# EAGLE design Atmega_128 Dev Board (EAGLE 8.5.1)
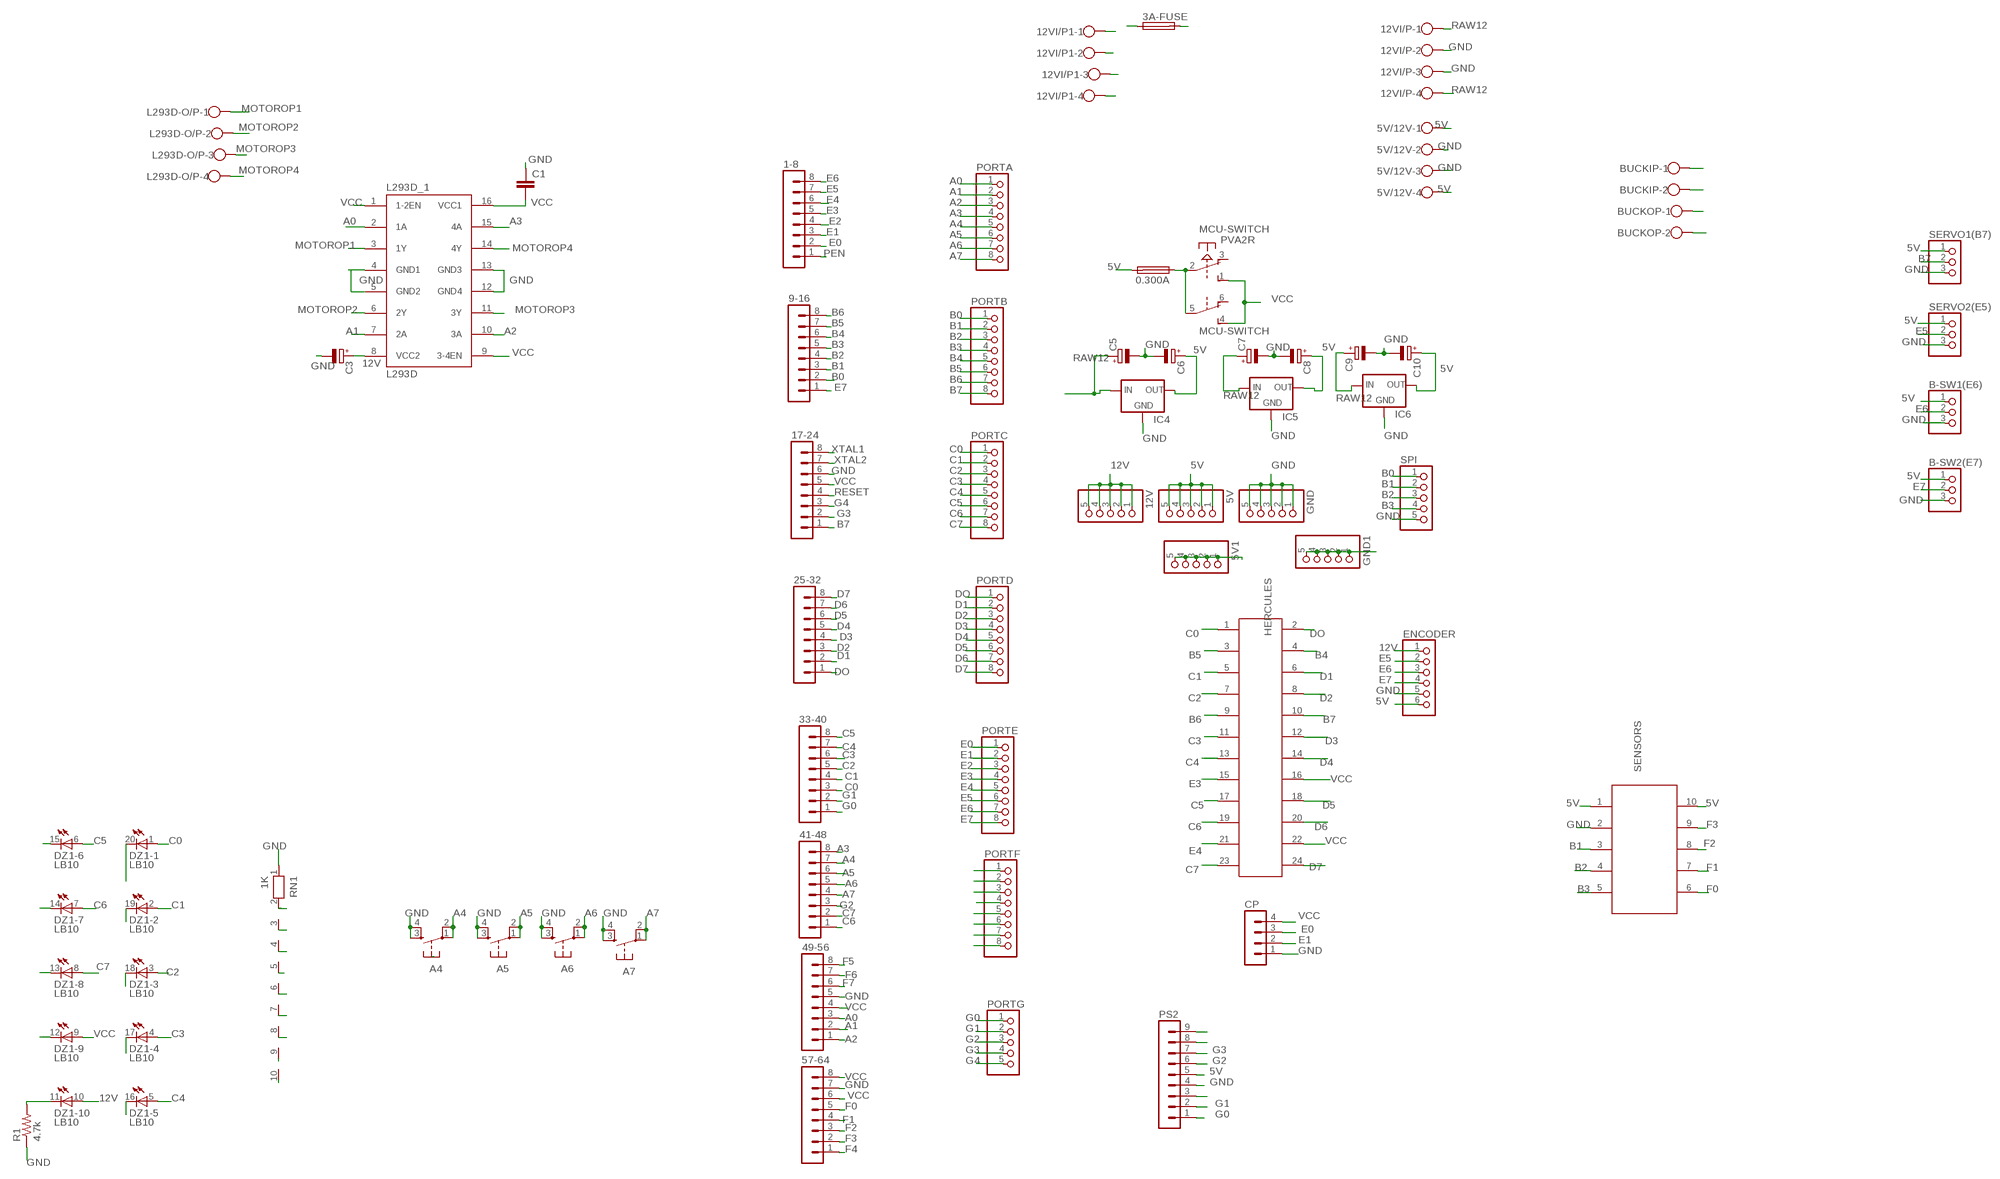
[diagram p0: schematic, sheet 1]

## Parts
0.300A  SH25  [SH25]
1-8  MA08-1  [MA08-1]
3A-FUSE  SH25  [SH25]
5V  PINHD-1X5  [1X05]
5V1  PINHD-1X5  [1X05]
5V/12V  W237-4  [W237-4]
9-16  MA08-1  [MA08-1]
12V  PINHD-1X5  [1X05]
12VI/P  W237-4  [W237-4]
12VI/P1  W237-4  [W237-4]
17-24  MA08-1  [MA08-1]
25-32  MA08-1  [MA08-1]
33-40  MA08-1  [MA08-1]
41-48  MA08-1  [MA08-1]
49-56  MA08-1  [MA08-1]
57-64  MA08-1  [MA08-1]
A4  DTS-6  [DTS-6]
A5  DTS-6  [DTS-6]
A6  DTS-6  [DTS-6]
A7  DTS-6  [DTS-6]
B-SW1(E6)  PINHD-1X3  [1X03]
B-SW2(E7)  PINHD-1X3  [1X03]
BUCKIP  W237-102  [W237-102]
BUCKOP  W237-102  [W237-102]
C1  C5/2.5  [C5B2.5]
C3  CPOL-EUE2.5-5  [E2,5-5]
C5  CPOL-EUE2.5-5  [E2,5-5]
C6  CPOL-EUE2.5-5  [E2,5-5]
C7  CPOL-EUE2.5-5  [E2,5-5]
C8  CPOL-EUE2.5-5  [E2,5-5]
C9  CPOL-EUE2.5-5  [E2,5-5]
C10  CPOL-EUE2.5-5  [E2,5-5]
CP  MA04-1  [MA04-1]
DZ1  LB10  [LB10]
ENCODER  PINHD-1X6  [1X06]
GND  PINHD-1X5  [1X05]
GND1  PINHD-1X5  [1X05]
HERCULES  61202421621  [61202421621]
IC4  78XXS  [78XXS]
IC5  78XXS  [78XXS]
IC6  78XXS  [78XXS]
L293D-O/P  W237-4  [W237-4]
L293D_1  L293D  [DIL16]
MCU-SWITCH  PVA2R  [PVA2R]
PORTA  PINHD-1X8  [1X08]
PORTB  PINHD-1X8  [1X08]
PORTC  PINHD-1X8  [1X08]
PORTD  PINHD-1X8  [1X08]
PORTE  PINHD-1X8  [1X08]
PORTF  PINHD-1X8  [1X08]
PORTG  PINHD-1X5  [1X05]
PS2  MA09-1  [MA09-1]
R1  4.7k  R-US_0204/7  [0204/7]
RN1  1K  RN09  [RN-10]
SENSORS  66101021622  [66101021622]
SERVO1(B7)  PINHD-1X3  [1X03]
SERVO2(E5)  PINHD-1X3  [1X03]
SPI  PINHD-1X5  [1X05]

## Nets
2: DZ1.12(-9:C) RN1.2
3: DZ1.13(-8:C) RN1.3
4: DZ1.14(-7:C) RN1.4
5: DZ1.15(-6:C) RN1.5
5V: 0.300A.2 5V1.1 5V1.2 5V1.3 5V1.4 5V1.5 5V.1 5V.2 5V.3 5V.4 5V.5 5V/12V.1 5V/12V.4 B-SW1(E6).1 B-SW2(E7).1 BUCKOP.2 C6.+ C8.+ C10.+ ENCODER.6 IC4.OUT IC5.OUT IC6.OUT PS2.5 SENSORS.1 SENSORS.10 SERVO1(B7).1 SERVO2(E5).1
5V-F: 0.300A.1 MCU-SWITCH.2(1:P) MCU-SWITCH.5(2:P)
6: DZ1.16(-5:C) RN1.6
7: DZ1.17(-4:C) RN1.7
8: DZ1.18(-3:C) RN1.8
9: DZ1.19(-2:C) RN1.9
10: DZ1.20(-1:C) RN1.10
12V: 3A-FUSE.2 12V.1 12V.2 12V.3 12V.4 12V.5 C3.+ DZ1.10(-10:A) ENCODER.1 L293D_1.8(VCC2)
A0: 49-56.3 L293D_1.2(1A) PORTA.1
A1: 49-56.2 L293D_1.7(2A) PORTA.2
A2: 49-56.1 L293D_1.10(3A) PORTA.3
A3: 41-48.8 L293D_1.15(4A) PORTA.4
A4: 41-48.7 A4.1 A4.2 PORTA.5
A5: 41-48.6 A5.1 A5.2 PORTA.6
A6: 41-48.5 A6.1 A6.2 PORTA.7
A7: 41-48.4 A7.1 A7.2 PORTA.8
B0: 9-16.2 PORTB.1 SPI.1
B1: 9-16.3 PORTB.2 SENSORS.3 SPI.2
B2: 9-16.4 PORTB.3 SENSORS.4 SPI.3
B3: 9-16.5 PORTB.4 SENSORS.5 SPI.4
B4: 9-16.6 HERCULES.4 PORTB.5
B5: 9-16.7 HERCULES.3 PORTB.6
B6: 9-16.8 HERCULES.9 PORTB.7
B7: 17-24.1 HERCULES.10 PORTB.8 SERVO1(B7).2
C0: 33-40.3 DZ1.1(-1:A) HERCULES.1 PORTC.1
C1: 33-40.4 DZ1.2(-2:A) HERCULES.5 PORTC.2
C2: 33-40.5 DZ1.3(-3:A) HERCULES.7 PORTC.3
C3: 33-40.6 DZ1.4(-4:A) HERCULES.11 PORTC.4
C4: 33-40.7 DZ1.5(-5:A) HERCULES.13 PORTC.5
C5: 33-40.8 DZ1.6(-6:A) HERCULES.17 PORTC.6
C6: 41-48.1 DZ1.7(-7:A) HERCULES.19 PORTC.7
C7: 41-48.2 DZ1.8(-8:A) HERCULES.23 PORTC.8
D1: 25-32.2 HERCULES.6 PORTD.2
D2: 25-32.3 HERCULES.8 PORTD.3
D3: 25-32.4 HERCULES.12 PORTD.4
D4: 25-32.5 HERCULES.14 PORTD.5
D5: 25-32.6 HERCULES.18 PORTD.6
D6: 25-32.7 HERCULES.20 PORTD.7
D7: 25-32.8 HERCULES.24 PORTD.8
DO: 25-32.1 HERCULES.2 PORTD.1
E0: 1-8.2 CP.3 PORTE.1
E1: 1-8.3 CP.2 PORTE.2
E2: 1-8.4 PORTE.3
E3: 1-8.5 HERCULES.15 PORTE.4
E4: 1-8.6 HERCULES.21 PORTE.5
E5: 1-8.7 ENCODER.2 PORTE.6 SERVO2(E5).2
E6: 1-8.8 B-SW1(E6).2 ENCODER.3 PORTE.7
E7: 9-16.1 B-SW2(E7).2 ENCODER.4 PORTE.8
F0: 57-64.5 PORTF.1 SENSORS.6
F1: 57-64.4 PORTF.2 SENSORS.7
F2: 57-64.3 PORTF.3 SENSORS.8
F3: 57-64.2 PORTF.4 SENSORS.9
F4: 57-64.1 PORTF.5
F5: 49-56.8 PORTF.6
F6: 49-56.7 PORTF.7
F7: 49-56.6 PORTF.8
G0: 33-40.1 PORTG.1 PS2.1
G1: 33-40.2 PORTG.2 PS2.2
G2: 41-48.3 PORTG.3 PS2.6
G3: 17-24.2 PORTG.4 PS2.7
G4: 17-24.3 PORTG.5
GND: 5V/12V.2 5V/12V.3 12VI/P1.2 12VI/P1.3 12VI/P.2 12VI/P.3 17-24.6 49-56.5 57-64.7 A4.3 A4.4 A5.3 A5.4 A6.3 A6.4 A7.3 A7.4 B-SW1(E6).3 B-SW2(E7).3 BUCKIP.2 BUCKOP.1 C1.1 C3.- C5.- C6.- C7.- C8.- C9.- C10.- CP.1 ENCODER.5 GND1.1 GND1.2 GND1.3 GND1.4 GND1.5 GND.1 GND.2 GND.3 GND.4 GND.5 IC4.GND IC5.GND IC6.GND L293D_1.4(GND1) L293D_1.5(GND2) L293D_1.12(GND4) L293D_1.13(GND3) PS2.4 R1.1 RN1.1 SENSORS.2 SERVO1(B7).3 SERVO2(E5).3 SPI.5
MOTOROP1: L293D-O/P.1 L293D_1.3(1Y)
MOTOROP2: L293D-O/P.2 L293D_1.6(2Y)
MOTOROP3: L293D-O/P.3 L293D_1.11(3Y)
MOTOROP4: L293D-O/P.4 L293D_1.14(4Y)
N$4: PS2.9
N$6: PS2.8
N$17: PS2.3
N$23: DZ1.11(-10:C) R1.2
PEN: 1-8.1
RAW12: 3A-FUSE.1 12VI/P1.1 12VI/P1.4 12VI/P.1 12VI/P.4 BUCKIP.1 C5.+ C7.+ C9.+ IC4.IN IC5.IN IC6.IN
RESET: 17-24.4
VCC: 17-24.5 49-56.4 57-64.6 57-64.8 C1.2 CP.4 DZ1.9(-9:A) HERCULES.16 HERCULES.22 L293D_1.1(1-2EN) L293D_1.9(3-4EN) L293D_1.16(VCC1) MCU-SWITCH.1(1:S) MCU-SWITCH.4(2:S)
XTAL1: 17-24.8
XTAL2: 17-24.7
Unconnected: MCU-SWITCH.3(1:O) MCU-SWITCH.6(2:O)

## Library data of the parts
0.300A 3A-FUSE = fuse:SH25: FUSE HOLDER grid 25 mm, OGN0031 8211, Schurter (Buerklin); MF: SCHURTER; MPN: 0031.8211; OC_FARNELL: 1162741; OC_NEWARK: 96B9380
1-8 9-16 17-24 25-32 33-40 41-48 49-56 57-64 = con-lstb:MA08-1: PIN HEADER; OC_FARNELL: unknown; OC_NEWARK: unknown
5V 5V1 12V GND GND1 PORTG SPI = pinhead:PINHD-1X5: PIN HEADER
5V/12V 12VI/P 12VI/P1 L293D-O/P = con-wago-500:W237-4: WAGO SCREW CLAMP; OC_FARNELL: unknown; OC_NEWARK: unknown
A4-A7 = switch-tact:DTS-6
B-SW1(E6) B-SW2(E7) SERVO1(B7) SERVO2(E5) = pinhead:PINHD-1X3: PIN HEADER
BUCKIP BUCKOP = con-wago-500:W237-102: WAGO SCREW CLAMP; MPN: 237-102; OC_FARNELL: unknown; OC_NEWARK: 70K9898
C1 = capacitor-wima:C: CAPACITOR naming: grid - package width
C3 C5-C10 = resistor:CPOL-EU: POLARIZED CAPACITOR, European symbol
CP = con-lstb:MA04-1: PIN HEADER; OC_FARNELL: unknown; OC_NEWARK: unknown
DZ1 = led:LB10: LED BLOCK 10-LED bar graph, DIL, Siemens
ENCODER = pinhead:PINHD-1X6: PIN HEADER
HERCULES = Wurth_Elektronik_Electromechanic_Wire_to_Board_Connectors_rev17b:61202421621: WR-BHD 2.54mm Male Box Header, 24 Pins=>Code : Con_WTB_BHD_2.54_Male_THT_WS_61202421621 <http://katalog.we-online.de/media/thumbs2/eican/thb_Con_WTB_BHD_2.54_Male_THT_WS_6120xx21621_pf2.jpg> Details see: http://katalog.we-online.de/en/em/612_0xx_216_21 Created 2014-06-04, Karrer Zheng 2014 (C) Würth Elektronik
IC4-IC6 = v-reg:78XXS: VOLTAGE REGULATOR
L293D_1 = st-microelectronics:L293D: PUSH-PULL 4 CHANNEL DRIVER; MPN: L293D; OC_FARNELL: 9589619; OC_NEWARK: 56P8249
MCU-SWITCH = switch-misc:PVA2R: ITT SWITCH
PORTA PORTB PORTC PORTD PORTE PORTF = pinhead:PINHD-1X8: PIN HEADER
PS2 = con-lstb:MA09-1: PIN HEADER; OC_FARNELL: unknown; OC_NEWARK: unknown
R1 = rcl:R-US_: RESISTOR, American symbol; SPICEPREFIX: R
RN1 = resistor-net:RN09: RESISTOR NETWORK; OC_FARNELL: unknown; OC_NEWARK: unknown
SENSORS = Wurth_Elektronik_Electromechanic_Wire_to_Board_Connectors_rev17b:66101021622: WIRE TO BOARD CONNECTION - 2.54 MM - SHROUDED HEADER - STRAIGHT - GLOW WIRE PLASTIC - WR-WTB =>ConWTB254 66101021622 Characteristics INSULATOR: PA46G15 FLAMMABILITY RATING: UL94V0 COLOR: BLACK METAL: PHOSPHOR BRONZE PLATING: TIN OVER Ni QUALITY CLASS: 25 MATING CYCLES OPERATING TEMPERATURE:-40°C UP TO +125°C COMPLIANCE: LEAD FREE AND ROHS ELECTRICAL CURRENT RATING: 3 A WORKING VOLTAGE: 50 VAC WITHSTANDING VOLTAGE: 500 VAC/MIN INSULATION RESISTANCE: >1000 MΩ CONTACT RESISTANCE: 20 mΩ MAX <http://katalog.we-online.de/media/images/v2/Family_WR-WTB_6610xx11622_2%2054.jpg> Details see: http://katalog.we-online.de/en/em/WTB_2_54_MALE_HORIZONTAL_SHROUDED_HEADER_GLOW_WIRE_PLASTIC_6610XXX1622 2015 (C) Wurth Elektronik

## Board
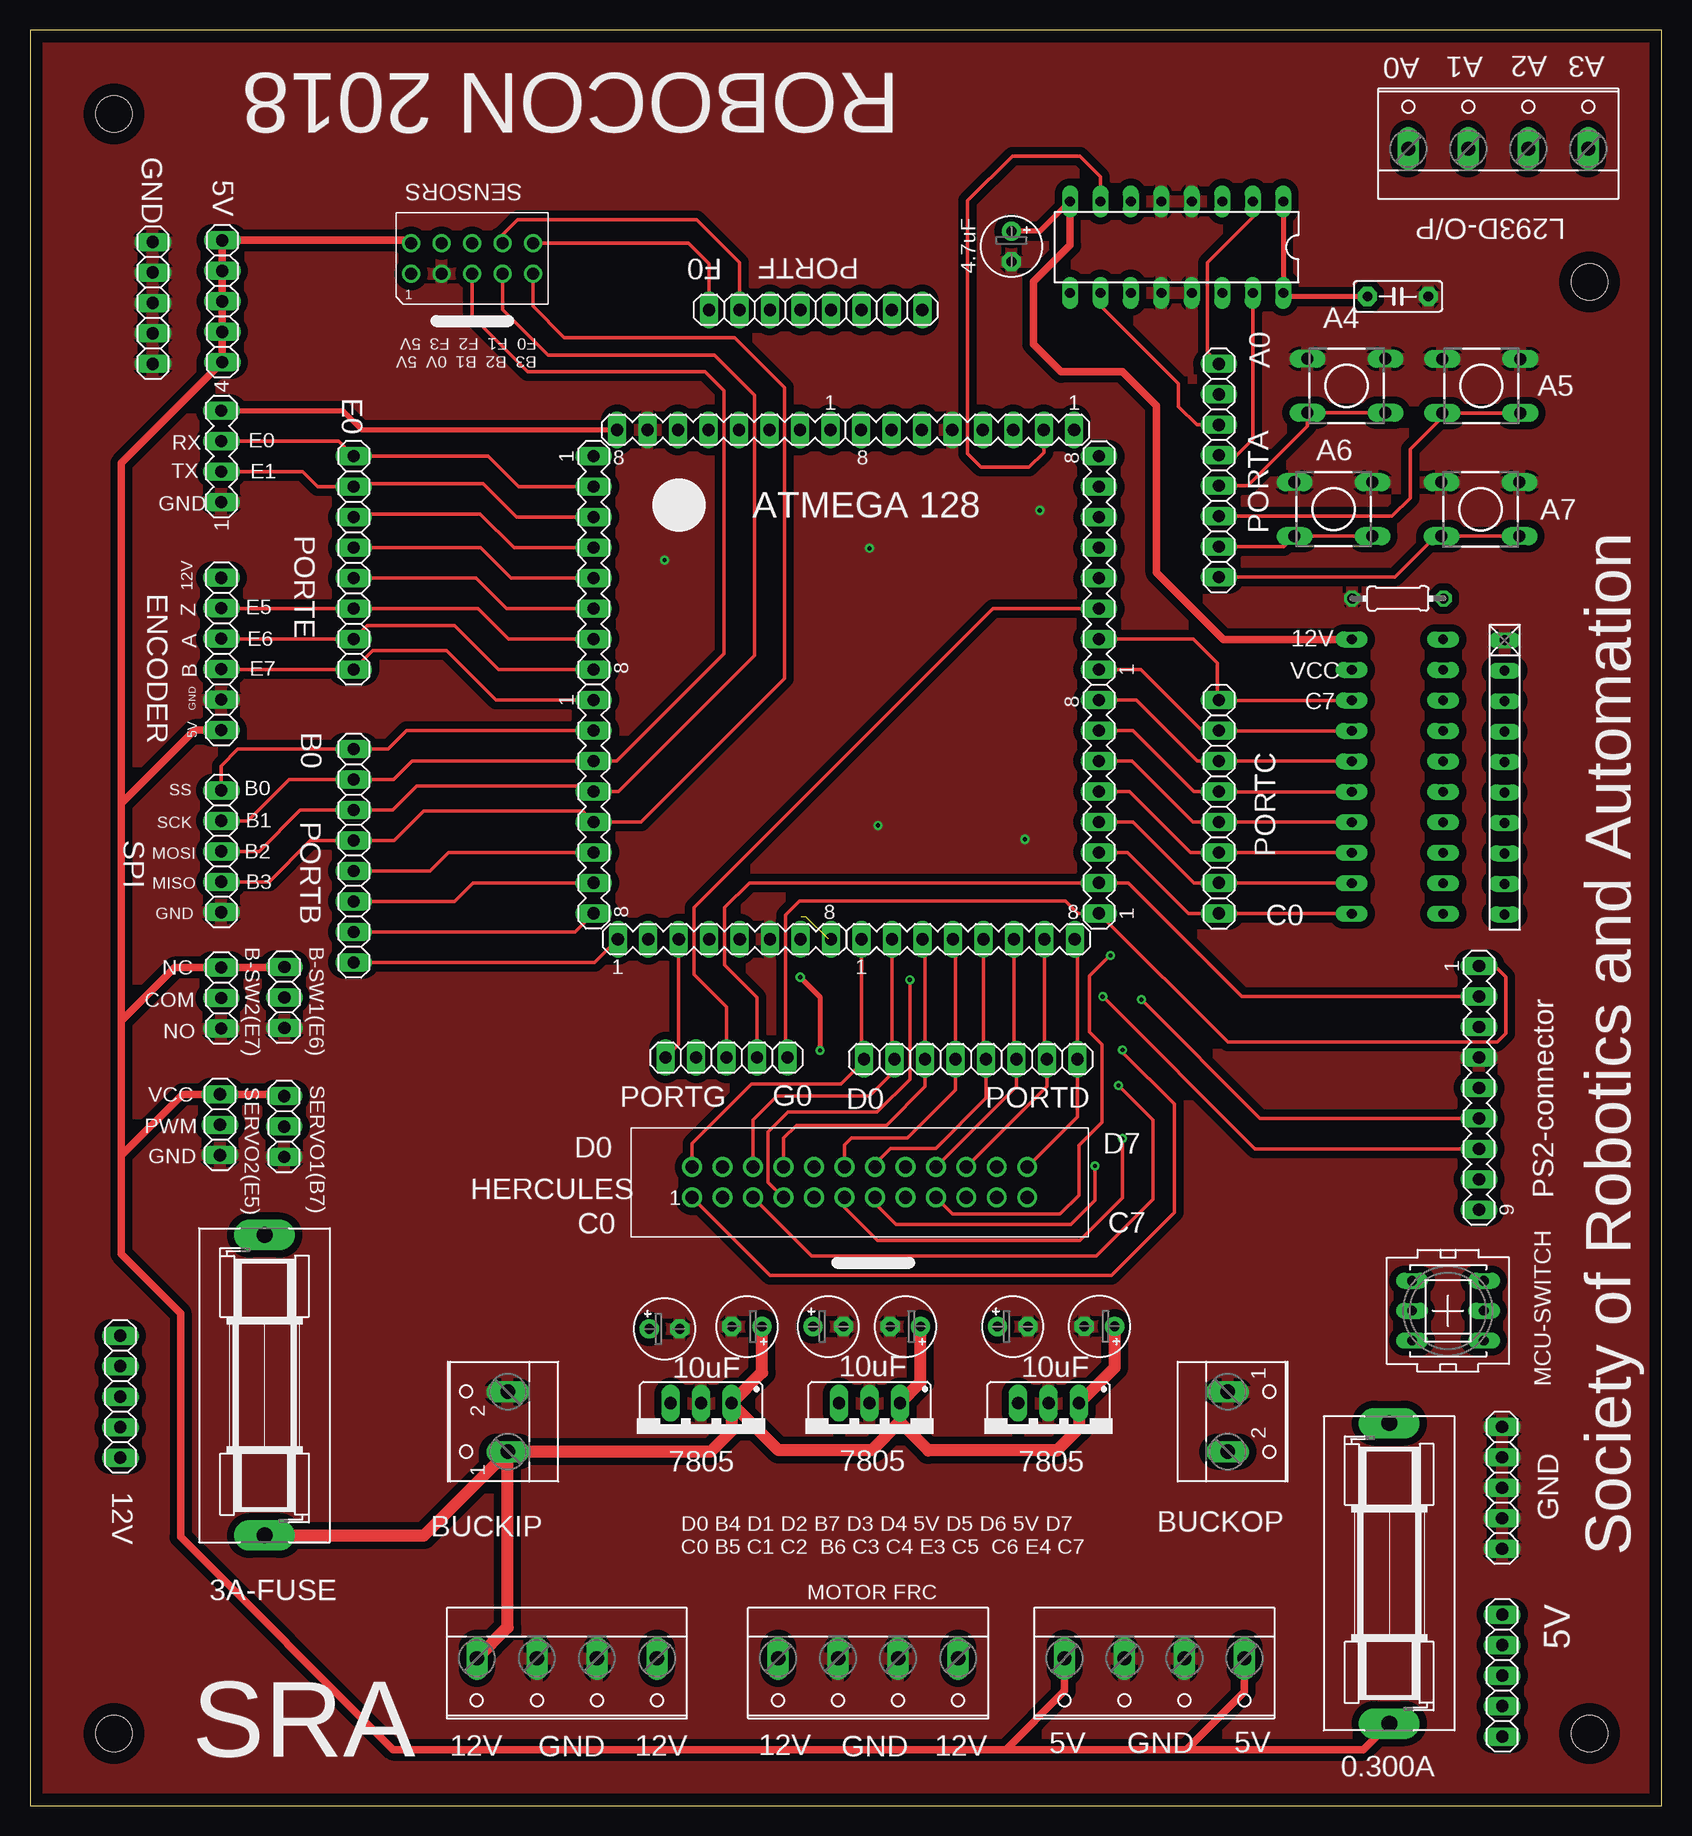
[diagram p1: board, top side]
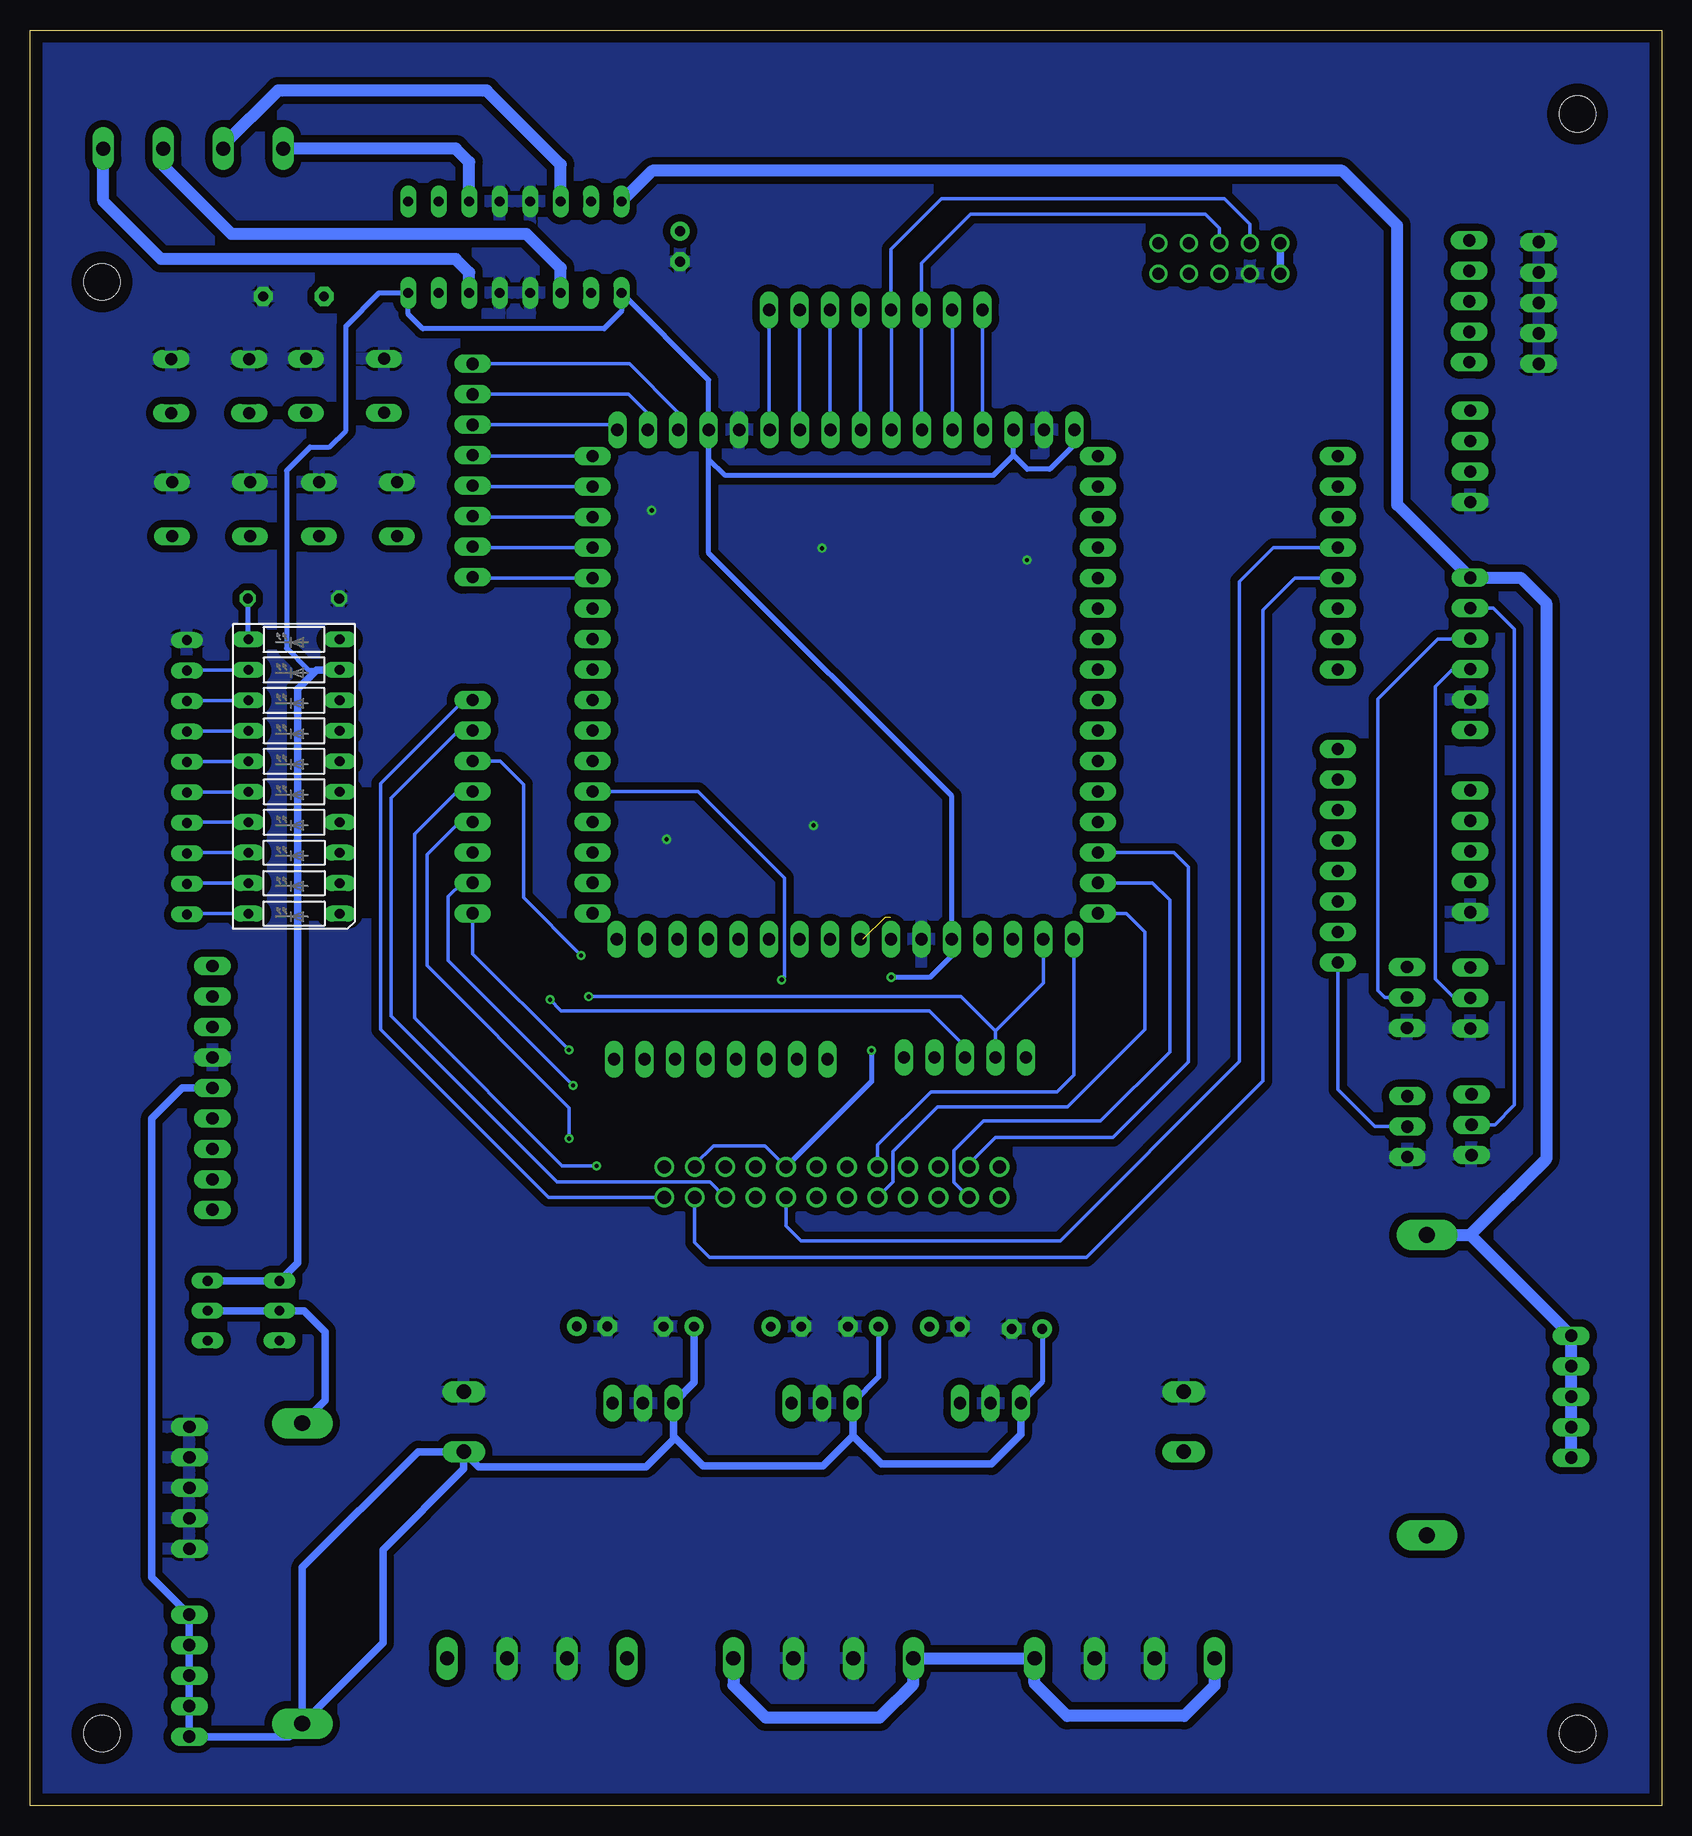
[diagram p2: board, bottom side, seen from below]

Size 136 x 148 mm. Coordinates in mm from the lower left corner, seen from the top.
Outline: 0,0 136,0 136,148 0,148 0,0
Copper layers (1*16): Top 0.035mm / dielectric 1.5mm / Bottom 0.035mm
Design rules "default *": minimum track width 6mil, minimum drill 0.35mm, track to track 20mil, track to pad 10mil, pad to pad 10mil, via to via 15mil, smd to smd 6mil, copper to edge 40mil, drill to drill 6mil, minimum pad ring 10mil, minimum via ring 8mil, stop-mask expansion 4mil, vias tented up to drill 0mil, thermal gap 10mil
Holes 3 mm at 7,6 7,141 130,6 130,127

### Footprints (pad centres in the part's own frame; a part is rotated, then mirrored left to right if it is on the bottom)
SH25 = drill 1.321 pad 2.54 long: 1 -12.522,0; 2 12.522,0
MA08-1 = drill 1.016 long: 1 -8.89,0; 2 -6.35,0; 3 -3.81,0; 4 -1.27,0; 5 1.27,0; 6 3.81,0; 7 6.35,0; 8 8.89,0
1X05 = drill 1.016 long: 1 -5.08,0; 2 -2.54,0; 3 0,0; 4 2.54,0; 5 5.08,0
W237-4 = drill 1.194 long: 1 -7.5,-1.27; 2 -2.5,-1.27; 3 2.5,-1.27; 4 7.5,-1.27
DTS-6 = drill 1 long: 1 -3.25,2.25; 2 3.25,2.25; 3 -3.25,-2.25; 4 3.25,-2.25
1X03 = drill 1.016 long: 1 -2.54,0; 2 0,0; 3 2.54,0
W237-102 = drill 1.194 long: 1 -2.5,-1.27; 2 2.5,-1.27
C5B2.5 = drill 0.813 pad 1.6 octagon: 1 -2.54,0; 2 2.54,0
E2,5-5 = drill 0.813 pad 1.6: + -1.27,0 | drill 0.813 pad 1.6 octagon: - 1.27,0
MA04-1 = drill 1.016 long: 1 -3.81,0; 2 -1.27,0; 3 1.27,0; 4 3.81,0
LB10 = drill 0.813 long: 1 -11.43,-3.81; 2 -8.89,-3.81; 3 -6.35,-3.81; 4 -3.81,-3.81; 5 -1.27,-3.81; 6 1.27,-3.81; 7 3.81,-3.81; 8 6.35,-3.81; 9 8.89,-3.81; 10 11.43,-3.81; 11 11.43,3.81; 12 8.89,3.81; 13 6.35,3.81; 14 3.81,3.81; 15 1.27,3.81; 16 -1.27,3.81; 17 -3.81,3.81; 18 -6.35,3.81; 19 -8.89,3.81; 20 -11.43,3.81
1X06 = drill 1.016 long: 1 -6.35,0; 2 -3.81,0; 3 -1.27,0; 4 1.27,0; 5 3.81,0; 6 6.35,0
61202421621 = drill 1.1: 1 -13.97,-1.27; 2 -13.97,1.27; 3 -11.43,-1.27; 4 -11.43,1.27; 5 -8.89,-1.27; 6 -8.89,1.27; 7 -6.35,-1.27; 8 -6.35,1.27; 9 -3.81,-1.27; 10 -3.81,1.27; 11 -1.27,-1.27; 12 -1.27,1.27; 13 1.27,-1.27; 14 1.27,1.27; 15 3.81,-1.27; 16 3.81,1.27; 17 6.35,-1.27; 18 6.35,1.27; 19 8.89,-1.27; 20 8.89,1.27; 21 11.43,-1.27; 22 11.43,1.27; 23 13.97,-1.27; 24 13.97,1.27
78XXS = drill 1.016 long: GND 0,-2.54; IN -2.54,-2.54; OUT 2.54,-2.54
DIL16 = drill 0.813 long: 1 -8.89,-3.81; 2 -6.35,-3.81; 3 -3.81,-3.81; 4 -1.27,-3.81; 5 1.27,-3.81; 6 3.81,-3.81; 7 6.35,-3.81; 8 8.89,-3.81; 9 8.89,3.81; 10 6.35,3.81; 11 3.81,3.81; 12 1.27,3.81; 13 -1.27,3.81; 14 -3.81,3.81; 15 -6.35,3.81; 16 -8.89,3.81
PVA2R = drill 0.813 long: 1 -2.997,2.489; 2 -2.997,0; 3 -2.997,-2.489; 4 2.997,2.489; 5 2.997,0; 6 2.997,-2.489
1X08 = drill 1.016 long: 1 -8.89,0; 2 -6.35,0; 3 -3.81,0; 4 -1.27,0; 5 1.27,0; 6 3.81,0; 7 6.35,0; 8 8.89,0
MA09-1 = drill 1.016 long: 1 -10.16,0; 2 -7.62,0; 3 -5.08,0; 4 -2.54,0; 5 0,0; 6 2.54,0; 7 5.08,0; 8 7.62,0; 9 10.16,0
0204/7 = drill 0.813 octagon: 1 -3.81,0; 2 3.81,0
RN-10 = drill 0.813 long: 1 -11.43,0; 2 -8.89,0; 3 -6.35,0; 4 -3.81,0; 5 -1.27,0; 6 1.27,0; 7 3.81,0; 8 6.35,0; 9 8.89,0; 10 11.43,0
66101021622 = drill 1: 1 5.08,1.27; 2 2.54,1.27; 3 0,1.27; 4 -2.54,1.27; 5 -5.08,1.27; 6 -5.08,-1.27; 7 -2.54,-1.27; 8 0,-1.27; 9 2.54,-1.27; 10 5.08,-1.27

### Placement (x,y rotation side)
0.300A  113.3,19.35 270 top
1-8  46.98,103.58 270 top
3A-FUSE  19.55,35.03 90 top
5V  122.72,10.83 270 top
5V1  16.03,125.38 270 top
5V/12V  93.73,11 180 top
9-16  46.98,83.26 270 top
12V  7.53,34.08 270 top
12VI/P  69.87,11 180 top
12VI/P1  44.76,11 180 top
17-24  57.89,72.21 0 top
25-32  78.2,72.21 0 top
33-40  89.11,83.26 90 top
41-48  89.11,103.58 90 top
49-56  78.15,114.67 180 top
57-64  57.83,114.67 180 top
A4  109.74,118.34 180 top
A5  120.98,118.33 180 top
A6  108.66,108.06 180 top
A7  120.91,108.05 180 top
B-SW1(E6)  21.21,67.36 270 top
B-SW2(E7)  15.94,67.31 270 top
BUCKIP  38.56,32 90 top
BUCKOP  101.11,32 270 top
C1  114.03,125.79 180 top
C3  81.81,129.95 270 top
C5  59.76,39.92 180 top
C6  52.89,39.73 0 top
C7  72.97,39.92 180 top
C8  66.54,39.92 0 top
C9  89.15,39.94 180 top
C10  81.92,39.92 0 top
CP  15.95,112.46 90 top
DZ1  113.99,85.77 90 bottom
ENCODER  15.95,95.99 270 top
GND  122.71,26.48 270 top
GND1  10.24,125.25 270 top
HERCULES  69.16,51.95 0 top
IC4  55.94,31 180 top
IC5  69.98,31 180 top
IC6  84.91,31 180 top
L293D-O/P  122.39,139.38 0 top
L293D_1  95.58,129.9 180 top
MCU-SWITCH  118.2,41.24 0 top
PORTA  99.11,111.28 270 top
PORTB  26.98,79.17 270 top
PORTC  99.11,83.26 90 top
PORTD  78.42,62.21 0 top
PORTE  26.98,103.58 270 top
PORTF  65.49,124.67 0 top
PORTG  58.07,62.35 180 top
PS2  120.79,59.82 270 top
R1  114.03,100.61 0 top
RN1  122.92,85.71 270 top
SENSORS  36.85,128.96 180 top
SERVO1(B7)  21.18,56.59 270 top
SERVO2(E5)  15.84,56.75 270 top
SPI  15.95,79.54 270 top

### Tracks (layer width: path | path; a pad name or v marks a point on that pad's centre or on a via)
2
  Bottom 0.305: DZ1.12 122.86,94.66 RN1.2
3
  Bottom 0.305: DZ1.13 122.86,92.12 RN1.3
4
  Bottom 0.305: DZ1.14 122.86,89.58 RN1.4
5
  Bottom 0.305: DZ1.15 122.86,87.04 RN1.5
5V
  Top 0.61: 15.95,120.22 5V1.5 | 5V1.5 5V1.4 5V1.3 5V1.2 5V1.1 31.54,130.46 SENSORS.10 | 5V1.5 7.62,111.89 7.62,83.54 | 7.62,83.54 7.62,65.41 | ENCODER.6 13.72,89.64 7.62,83.54 | 7.62,65.41 12.06,69.85 B-SW2(E7).1 21.16,69.85 B-SW1(E6).1 | 81.34,4.66 30.28,4.66 12.56,22.38 12.56,41.04 7.62,45.98 7.62,54.2 | 81.34,4.66 96.41,4.66 | 96.41,4.66 111.13,4.66 0.300A.2 | 7.62,65.41 7.62,54.2 | 7.62,54.2 12.71,59.29 SERVO2(E5).1 21.02,59.29 SERVO1(B7).1 | 5V/12V.4 86.23,9.55 81.34,4.66 | 5V/12V.1 101.23,9.48 96.41,4.66
  Bottom 0.406: C8.+ 65.27,35.71 IC5.OUT | C6.+ 51.62,35.32 IC4.OUT
  Bottom 0.61: IC4.OUT 53.4,30.92 55.86,28.46 65.03,28.46 67.38,30.81 | 67.38,30.81 67.38,33.48 IC5.OUT | 82.37,30.78 IC6.OUT 80.65,35.26 C10.+ | 67.38,30.81 69.88,28.31 79.9,28.31 82.37,30.78 | 82.37,30.78 82.37,30.53 84.65,28.25 98.59,28.25 BUCKOP.2 | 0.300A.2 114.38,5.75 5V.5 5V.4 5V.3 5V.2 5V.1 125.84,19.03 125.84,57.29 123.31,59.82 PS2.5 | 0.300A.2 106.57,13.56 106.57,21.33 99.84,28.06 BUCKOP.2 | 0.300A.2 113.3,19.84 103.64,29.5 BUCKOP.2 | SENSORS.10 SENSORS.1
5V-F
  Bottom 0.61: MCU-SWITCH.5 MCU-SWITCH.2 113.15,41.24 111.41,39.5 111.41,33.76 0.300A.1
6
  Bottom 0.305: DZ1.16 122.86,84.5 RN1.6
7
  Bottom 0.305: DZ1.17 122.86,81.96 RN1.7
8
  Bottom 0.305: DZ1.18 122.86,79.42 RN1.8
9
  Bottom 0.305: DZ1.19 122.86,76.88 RN1.9
10
  Bottom 0.305: DZ1.20 122.86,74.34 RN1.10
12V
  Top 0.406: L293D_1.8 84.2,131.22 C3.+
  Top 0.61: DZ1.10 99.48,97.2 93.91,102.77 93.91,116.68 91.07,119.52 85.94,119.52 83.64,121.82 83.64,127.01 86.69,130.06 L293D_1.8
  Bottom 1.016: 12V.5 12V.4 12V.3 12V.2 12V.1 15.92,47.55 | L293D_1.8 84.13,136.27 26.61,136.27 22.03,131.69 22.03,108.42 ENCODER.1 11.73,102.34 9.62,100.23 9.62,53.85 15.92,47.55 | 3A-FUSE.2 15.92,47.55
A0
  Top 0.305: 101.93,133.19 L293D_1.2 101.93,132.39 98.13,128.59 98.13,121.15 PORTA.1
  Bottom 0.305: 49-56.3 81.96,116.12 86.01,120.17 PORTA.1
A1
  Top 0.305: 49-56.2 84.5,112.77 83.29,111.56 79.26,111.56 78.15,112.67 78.15,133.76 81.88,137.49 87.51,137.49 89.23,135.77 L293D_1.7
  Bottom 0.305: 49-56.2 84.5,116.02 86.11,117.63 PORTA.2
A2
  Top 0.305: PORTA.3 97.25,115.09 95.72,116.62 95.72,118.54 89.23,125.03 L293D_1.10
  Bottom 0.305: 49-56.1 87.46,115.09 PORTA.3
A3
  Top 0.305: PORTA.4 100.59,112.55 101.93,113.89 L293D_1.15
  Bottom 0.305: 41-48.8 99.03,112.47 PORTA.4
A4
  Top 0.305: PORTA.5 101.51,110.01 106.49,114.99 A4.2 A4.1
  Bottom 0.305: 41-48.7 99.03,109.93 PORTA.5
A5
  Top 0.305: A5.1 A5.2 117.73,115.72 115.07,113.06 115.07,109 113.54,107.47 PORTA.6
  Bottom 0.305: 41-48.6 99.03,107.39 PORTA.6
A6
  Top 0.305: PORTA.7 104.53,104.93 A6.2 A6.1
  Bottom 0.305: 41-48.5 99.03,104.85 PORTA.7
A7
  Top 0.305: PORTA.8 113.78,102.39 117.19,105.8 A7.2 A7.1
  Bottom 0.305: 41-48.4 99.03,102.31 PORTA.8
B0
  Top 0.305: 9-16.2 31.41,89.61 29.86,88.06 27.81,88.06 PORTB.1 17.33,88.06 15.93,86.66 15.95,86.64 SPI.1
B1
  Top 0.305: SENSORS.3 36.85,124.14 41.48,119.51 56.27,119.51 57.84,117.94 57.84,96.02 48.89,87.07 9-16.3 31.85,87.07 30.3,85.52 PORTB.2 21.6,85.52 18.16,82.08 SPI.2
B2
  Top 0.305: SENSORS.4 39.39,124.7 43.2,120.89 57.07,120.89 60.38,117.58 60.38,95.85 49.06,84.53 9-16.4 46.53,84.98 32.24,84.98 30.24,82.98 27.31,82.98 PORTB.3 22.53,82.98 19.09,79.54 SPI.3
B3
  Top 0.305: SENSORS.5 41.93,124.96 44.52,122.37 58.73,122.37 62.91,118.19 62.91,93.95 50.95,81.99 9-16.5 46.07,82.9 32.8,82.9 30.34,80.44 27.14,80.44 PORTB.4 23.37,80.44 19.93,77 SPI.4
B4
  Top 0.305: PORTB.5 33.34,77.9 34.89,79.45 9-16.6
  Bottom 0.305: 9-16.6 40.66,79.45 39.45,78.24 39.45,61.97 45.72,55.7 55.52,55.7 57.73,53.49 HERCULES.4
B5
  Top 0.305: PORTB.6 35.4,75.36 36.95,76.91 9-16.7
  Bottom 0.305: HERCULES.3 58.99,51.94 58.99,54.59 56.52,57.06 46.76,57.06 41,62.82 41,75.47 42.44,76.91 9-16.7
B6
  Top 0.305: PORTB.7 45.43,72.82 9-16.8
  Bottom 0.305: HERCULES.9 64.07,51.96 64.07,54.52 60.36,58.23 49.52,58.23 43.05,64.7 43.05,72.83 44.59,74.37 9-16.8
B7
  Top 0.305: PORTB.8 47.07,70.28 17-24.1
  Bottom 0.305: HERCULES.10 65.35,55.06 60.91,59.5 50.4,59.5 48.99,60.91 17-24.1 | SERVO1(B7).2 23.9,56.59 26.98,59.67 PORTB.8
C0  (via drill 0.35)
  Top 0.305: DZ1.1 99.14,74.34 | 99.14,74.34 PORTC.1 | 33-40.3 91.46,79.45 96.57,74.34 99.14,74.34 | HERCULES.1 61.68,44.19 90.15,44.19 95.39,49.43 95.39,58.46 91.08,62.77 v91.08,62.97
  Bottom 0.305: PORTC.1 99.11,71 v91.08,62.97
C1  (via drill 0.35)
  Top 0.305: HERCULES.5 65.13,45.82 88.91,45.82 93.61,50.52 93.61,57.14 v90.73,60.02 | 33-40.4 91.93,81.99 97.01,76.91 PORTC.2 99.14,76.88 DZ1.2
  Bottom 0.305: PORTC.2 99.99,76.91 101.13,75.77 101.13,70.42 v90.73,60.02
C2  (via drill 0.35)
  Top 0.305: 33-40.5 91.63,84.53 96.71,79.45 PORTC.3 99.14,79.42 DZ1.3 | HERCULES.7 61.54,51.95 61.54,56.14 63.2,57.8 70.61,57.8 73.34,60.53 v73.34,68.83
  Bottom 0.305: v73.34,68.83 73.11,69.06 73.11,77.31 80.33,84.53 33-40.5
C3  (via drill 0.35)
  Top 0.305: HERCULES.11 67.89,49.86 70.64,47.11 87.54,47.11 91.06,50.63 v91.06,55.59 | 33-40.6 91.85,87.07 96.93,81.99 PORTC.4 99.14,81.96 DZ1.4
  Bottom 0.305: PORTC.4 100.18,81.99 102.91,79.26 102.91,70.01 91.06,58.16 v91.06,55.59
C4  (via drill 0.35)
  Top 0.305: HERCULES.13 70.43,50.2 72.18,48.45 86.76,48.45 88.76,50.45 v88.76,53.32 | 33-40.7 91.92,89.61 97,84.53 PORTC.5 99.14,84.5 DZ1.5
  Bottom 0.305: PORTC.5 100.38,84.53 103.94,80.97 103.94,65.63 91.63,53.32 v88.76,53.32
C5  (via drill 0.35)
  Top 0.305: HERCULES.17 76.88,49.31 85.86,49.31 87.42,50.87 87.42,55.01 89.34,56.93 89.34,63.43 88.31,64.46 88.31,69.13 90.04,70.86 v90.06,70.86 | 33-40.8 92.22,92.15 97.3,87.07 PORTC.6 110.15,87.07 DZ1.6
  Bottom 0.305: v90.06,70.86 94.87,75.67 94.87,85.11 96.83,87.07 PORTC.6
C6
  Top 0.305: 41-48.1 92.62,94.69 97.7,89.61 PORTC.7 99.14,89.58 DZ1.7
  Bottom 0.305: PORTC.7 100.26,89.61 105.89,83.98 105.89,65.8 92.05,51.96 79.33,51.96 HERCULES.19
C7
  Top 0.305: 41-48.2 96.97,97.23 98.96,95.24 98.96,92.3 PORTC.8 99.14,92.12 DZ1.8
  Bottom 0.305: PORTC.8 99.81,92.15 106.79,85.17 106.79,64.7 92.77,50.68 HERCULES.23
D1
  Top 0.305: 25-32.2 71.85,62.43 PORTD.2 72.07,61.23 69.97,59.13 62.26,59.13 60.27,57.14 HERCULES.6
D2
  Top 0.305: 25-32.3 74.61,71.99 PORTD.3 74.61,59.92 71.39,56.7 63.88,56.7 62.81,55.63 HERCULES.8
D3
  Top 0.305: 25-32.4 77.15,71.99 PORTD.4 77.15,59.63 73.15,55.63 68.46,55.63 67.89,55.06 HERCULES.12 67.89,53.61
D4
  Top 0.305: 25-32.5 79.47,62.43 PORTD.5 79.69,58.97 75.5,54.78 71.73,54.78 70.43,53.48 HERCULES.14
D5
  Top 0.305: 25-32.6 82.01,62.43 PORTD.6 82.23,59.94 HERCULES.18
D6
  Top 0.305: 25-32.7 84.55,62.43 PORTD.7 84.77,59.94 HERCULES.20
D7
  Top 0.305: 25-32.8 87.31,71.99 PORTD.8 87.31,57.4 HERCULES.24
DO
  Top 0.305: 25-32.1 69.31,62.43 PORTD.1 69.53,62.06 67.62,60.15 60.15,60.15 55.19,55.19 HERCULES.2
E0
  Top 0.305: 1-8.2 40.71,109.93 38.17,112.47 PORTE.1 25.72,113.73 CP.3
E1
  Top 0.305: 1-8.3 40.55,107.39 37.75,110.19 27.24,110.19 PORTE.2 26.96,109.95 23.98,109.95 22.74,111.19 CP.2
E2
  Top 0.305: 1-8.4 40.34,104.85 37.53,107.66 27.25,107.66 PORTE.3
E3
  Top 0.305: PORTE.4 37.58,104.85 40.12,102.31 1-8.5
  Bottom 0.305: HERCULES.15 72.97,48.33 71.72,47.08 50.11,47.08 35.18,62.01 35.18,102.02 32.35,104.85 PORTE.4
E4
  Top 0.305: 1-8.6 39.72,99.77 37.18,102.31 PORTE.5
  Bottom 0.305: HERCULES.21 80.59,46.94 79.35,45.7 47.95,45.7 33.24,60.41 33.24,99.64 30.57,102.31 PORTE.5
E5
  Top 0.305: ENCODER.2 15.98,99.77 PORTE.6 37.35,99.77 39.89,97.23 1-8.7
  Bottom 0.305: ENCODER.2 14.02,99.8 12.27,98.05 12.27,58.39 13.91,56.75 SERVO2(E5).2
E6
  Top 0.305: 1-8.8 39.07,94.69 35.39,98.37 28.12,98.37 PORTE.7 15.98,97.23 ENCODER.3
  Bottom 0.305: ENCODER.3 15.98,97.23 18.63,97.23 23.65,92.21 23.65,67.95 23.06,67.36 B-SW1(E6).2
E7
  Top 0.305: 9-16.1 38.85,92.15 34.71,96.29 28.58,96.29 PORTE.8 15.98,94.69 ENCODER.4
  Bottom 0.305: B-SW2(E7).2 17.27,67.31 18.85,68.89 18.85,93.28 17.41,94.72 ENCODER.4
F0
  Top 0.305: SENSORS.6 54.89,130.23 56.6,128.52 PORTF.1
  Bottom 0.305: PORTF.1 56.6,114.71 57-64.5
F1
  Top 0.305: SENSORS.7 39.39,130.94 40.63,132.18 55.55,132.18 59.14,128.59 PORTF.2
  Bottom 0.305: 57-64.4 59.1,124.63 PORTF.2
F2
  Bottom 0.305: 57-64.3 61.68,114.71 PORTF.3 61.68,128.57 57.61,132.64 38.01,132.64 36.85,131.48 SENSORS.8
F3
  Bottom 0.305: 57-64.2 64.18,124.63 PORTF.4 64.22,129.75 60.02,133.95 36.44,133.95 34.31,131.82 SENSORS.9
F4
  Bottom 0.305: PORTF.5 66.76,114.71 57-64.1
F5
  Bottom 0.305: PORTF.6 69.3,114.71 49-56.8
F6
  Bottom 0.305: PORTF.7 71.84,114.71 49-56.7
F7
  Bottom 0.305: PORTF.8 74.38,114.71 49-56.6
G0
  Top 0.305: PS2.1 122.1,69.98 123.01,69.07 123.01,64.34 122.31,63.64 99.84,63.64 33-40.1 87.35,74.37 86.33,75.39 64.14,75.39 62.97,74.22 62.97,62.53 PORTG.1
G1
  Top 0.305: 33-40.2 59.96,76.91 57.9,74.85 57.9,70.05 60.61,67.34 PORTG.2 | 33-40.2 89.73,76.91 | PS2.2 101.02,67.44 91.55,76.91 33-40.2
G2  (via drill 0.35)
  Top 0.305: 41-48.3 80.25,99.77 55.35,74.87 55.35,69.28 58.07,66.56 PORTG.3 | v92.65,67.17 102.54,57.28 PS2.6
  Bottom 0.305: PORTG.3 58.07,63.27 61.04,66.24 91.72,66.24 v92.65,67.17
G3  (via drill 0.35)
  Top 0.305: 89.42,67.35 v89.42,67.42 102.1,54.74 PS2.7
  Bottom 0.305: 55.53,62.54 PORTG.4 55.53,64.56 | v89.42,67.42 58.39,67.42 55.53,64.56 | 17-24.2 51.54,68.55 55.53,64.56
G4
  Top 0.305: PORTG.5 54.08,63.44 17-24.3
GND  (via drill 0.35)
  other vias: 70.68,81.7 52.9,103.82 69.99,104.8 82.93,80.54 84.17,107.96
  pour Top (isolate 0.61): 1,147 135,147 135,1 1,1
  pour Bottom (isolate 0.61): 135,147 135,1 1,1 1,147
MOTOROP1
  Bottom 1.016: L293D_1.3 99.39,136.98 100.52,138.11 L293D-O/P.1
MOTOROP2
  Bottom 1.016: L293D_1.6 91.77,136.78 97.93,142.94 115.33,142.94 119.89,138.38 L293D-O/P.2
MOTOROP3
  Bottom 1.016: L293D_1.11 91.77,128.16 94.61,131 119.2,131 124.89,136.69 L293D-O/P.3
MOTOROP4
  Bottom 1.016: L293D_1.14 99.39,127.78 100.51,128.9 125.08,128.9 129.89,133.71 L293D-O/P.4
N$23
  Bottom 0.406: DZ1.11 117.8,100.61 R1.2
RAW12
  Top 1.016: IC4.IN 61.03,36.09 C5.+ | C7.+ 74.24,35.26 IC5.IN 72.52,31.96 | 72.52,31.96 70.18,29.62 62.4,29.62 IC4.IN | 72.52,31.96 74.89,29.59 85.62,29.59 87.45,31.42 IC6.IN 90.42,36.51 C9.+ | IC4.IN 58.48,31.24 56.74,29.5 BUCKIP.1 | 3A-FUSE.1 32.84,22.51 BUCKIP.1 | 12VI/P1.4 39.83,14.84 BUCKIP.1
  Bottom 1.016: 12VI/P1.4 37.26,9.99 39.79,7.46 49.55,7.46 52.26,10.17 12VI/P1.1 12VI/P.4 62.37,10.14 65.17,7.34 74.67,7.34 77.37,10.04 12VI/P.1
RESET
  Top 0.152: 17-24.4 57.16,72.75 57.16,72.79
VCC  (via drill 0.35)
  Top 0.406: 57-64.8 27.65,114.67 26.05,116.27 CP.4 | L293D_1.1 L293D_1.16 104.77,125.79 C1.2 | v64.21,69.04 65.85,67.4 v65.85,62.94
  Top 0.61: 16.03,116.35 CP.4
  Bottom 0.305: HERCULES.16 74.75,55 79.03,55 80.59,53.44 HERCULES.22
  Bottom 0.406: 57-64.8 48.94,113.44 50.99,111.39 52.86,111.39 54.02,112.55 | 54.02,112.55 57-64.6 | 49-56.4 79.42,104.39 59.16,84.13 17-24.5 59.16,70.84 60.96,69.04 v64.21,69.04 | DZ1.9 112.81,94.66 114.62,96.47 114.62,111.27 112.66,113.23 111.05,113.23 109.66,114.62 109.66,123.33 106.9,126.09 L293D_1.16 104.47,124.31 103.26,123.1 88.14,123.1 86.69,124.55 L293D_1.9 79.42,118.82 49-56.4 | 49-56.4 79.42,112.25 78.05,110.88 55.69,110.88 54.02,112.55 | v65.85,62.94 65.85,60.34 HERCULES.16
  Bottom 0.61: DZ1.9 112.12,94.66 113.7,93.08 113.7,45.23 MCU-SWITCH.1 MCU-SWITCH.4
XTAL1  (2 unrouted)
  Top 0.152: 17-24.8 66.55,72.21

### Text on the board
tNames: A0 | A1 | A2 | A3 | ROBOCON 2018 | GND | 5V | SENSORS | F0 | 4.7uF | B3 B2 B1 0V 5V / F0 F1 F2 F3 5V | A0 | E0 | RX | E0 | TX | E1 | GND | ATMEGA 128 | 12V | Z | E5 | A | E6 | 12V | B | E7 | VCC | GND | C7 | 5V | B0 | SS | B0 | SCK | B1 | MOSI | B2 | MISO | B3 | GND | C0 | NC | COM | NO | VCC | G0 | D0 | PWM | GND | D0 | D7 | PS2-connector | C0 | C7 | 10uF | 10uF | 10uF | 7805 | 7805 | 7805 | 12V | GND | Society of Robotics and Automation | D0 B4 D1 D2 B7 D3 D4 5V D5 D6 5V D7 / C0 B5 C1 C2 B6 C3 C4 E3 C5 C6 E4 C7 / / MOTOR FRC | 5V | SRA | 12V | GND | 12V | 12V | GND | 12V | 5V | GND | 5V